# EAGLE design ME433-2021-1 (EAGLE 9.6.2)
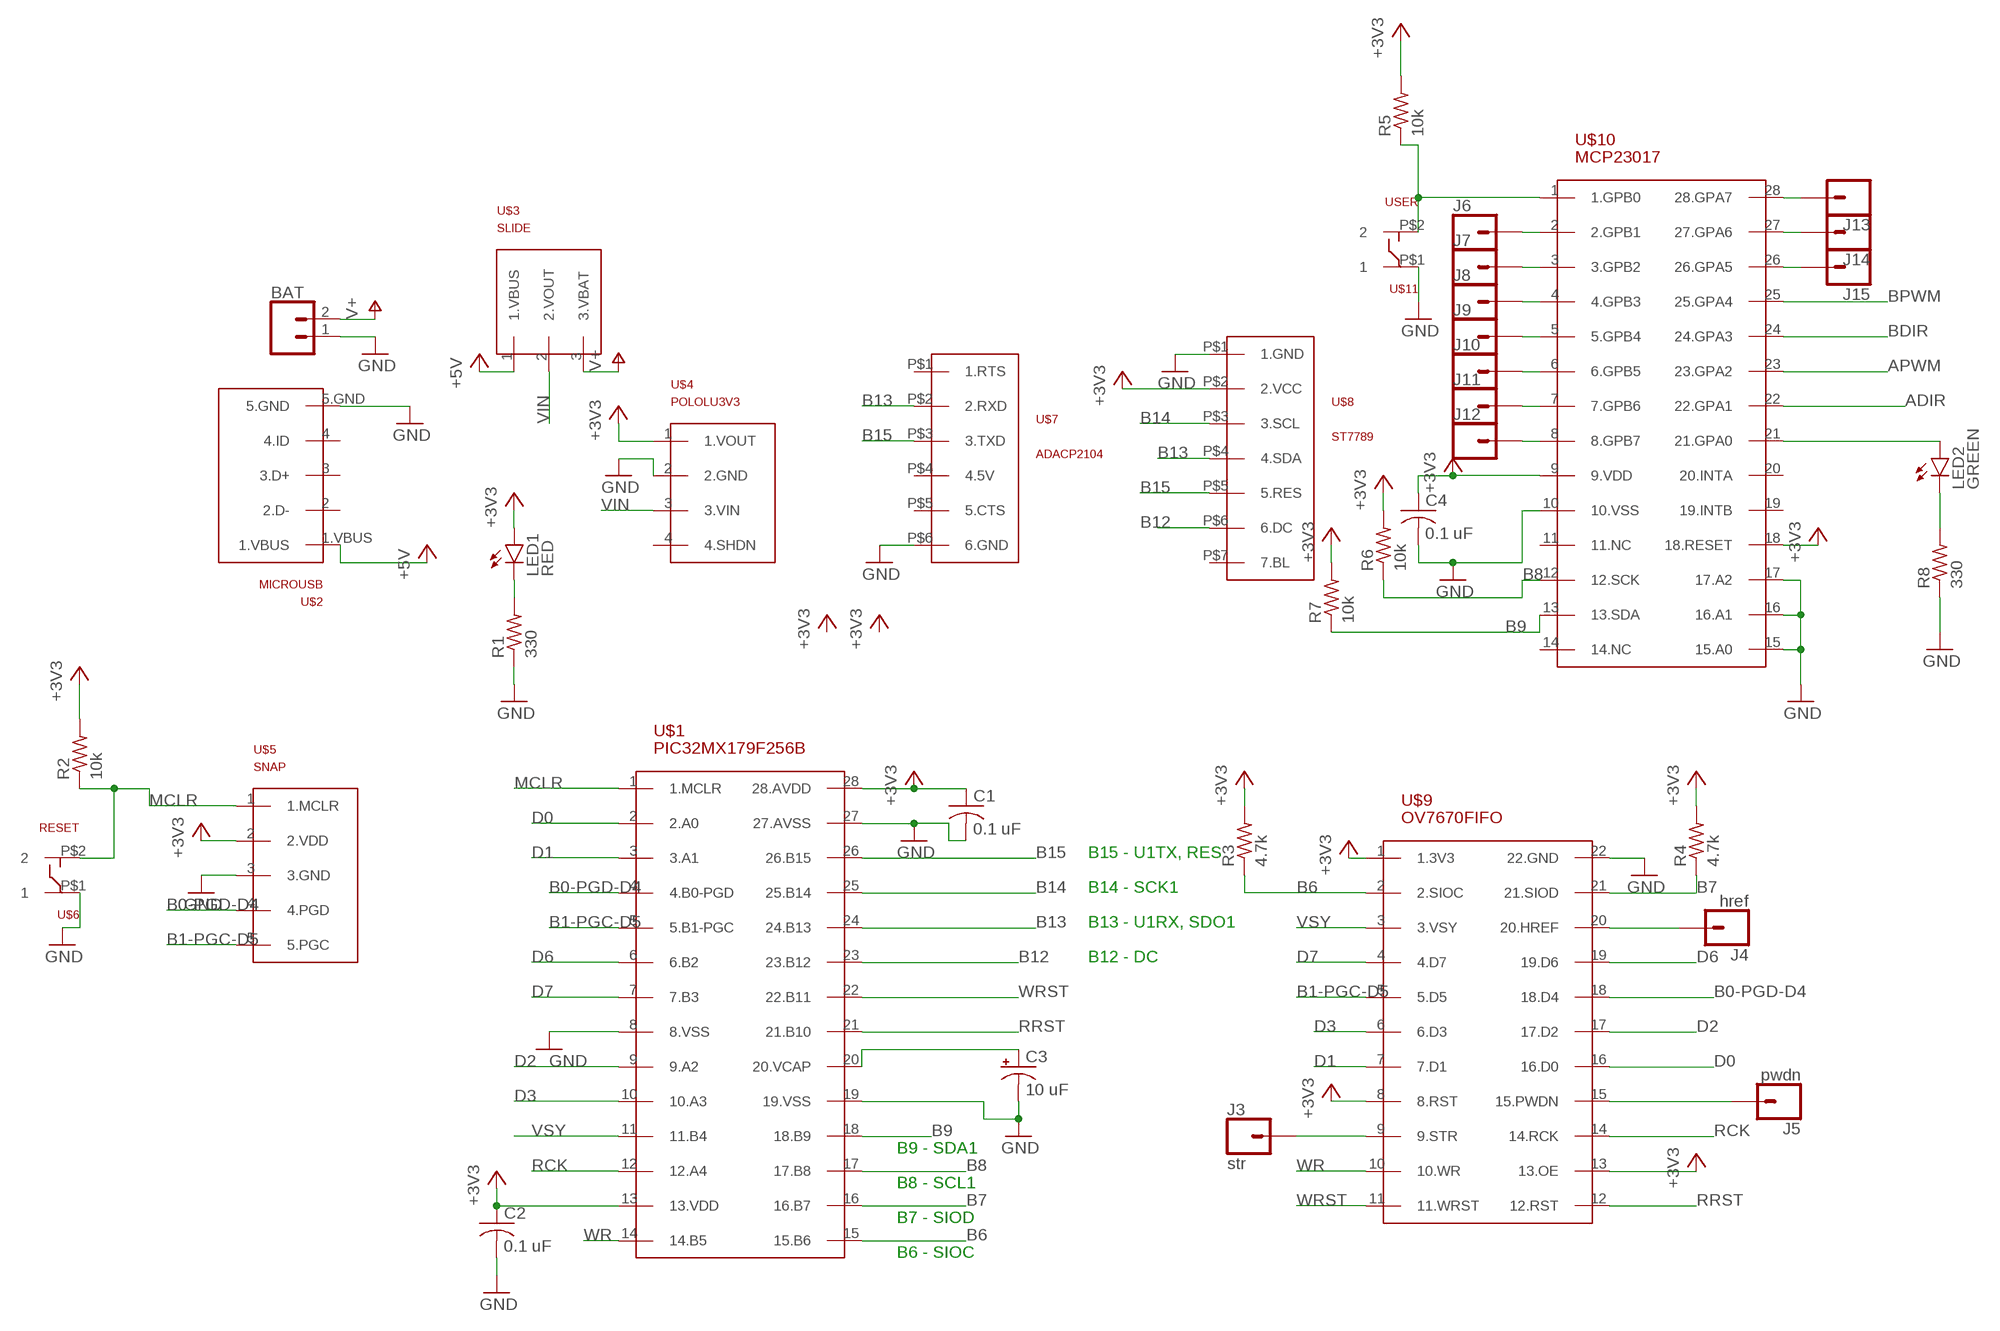
[diagram p0: schematic, sheet 1, part 1 of 2]
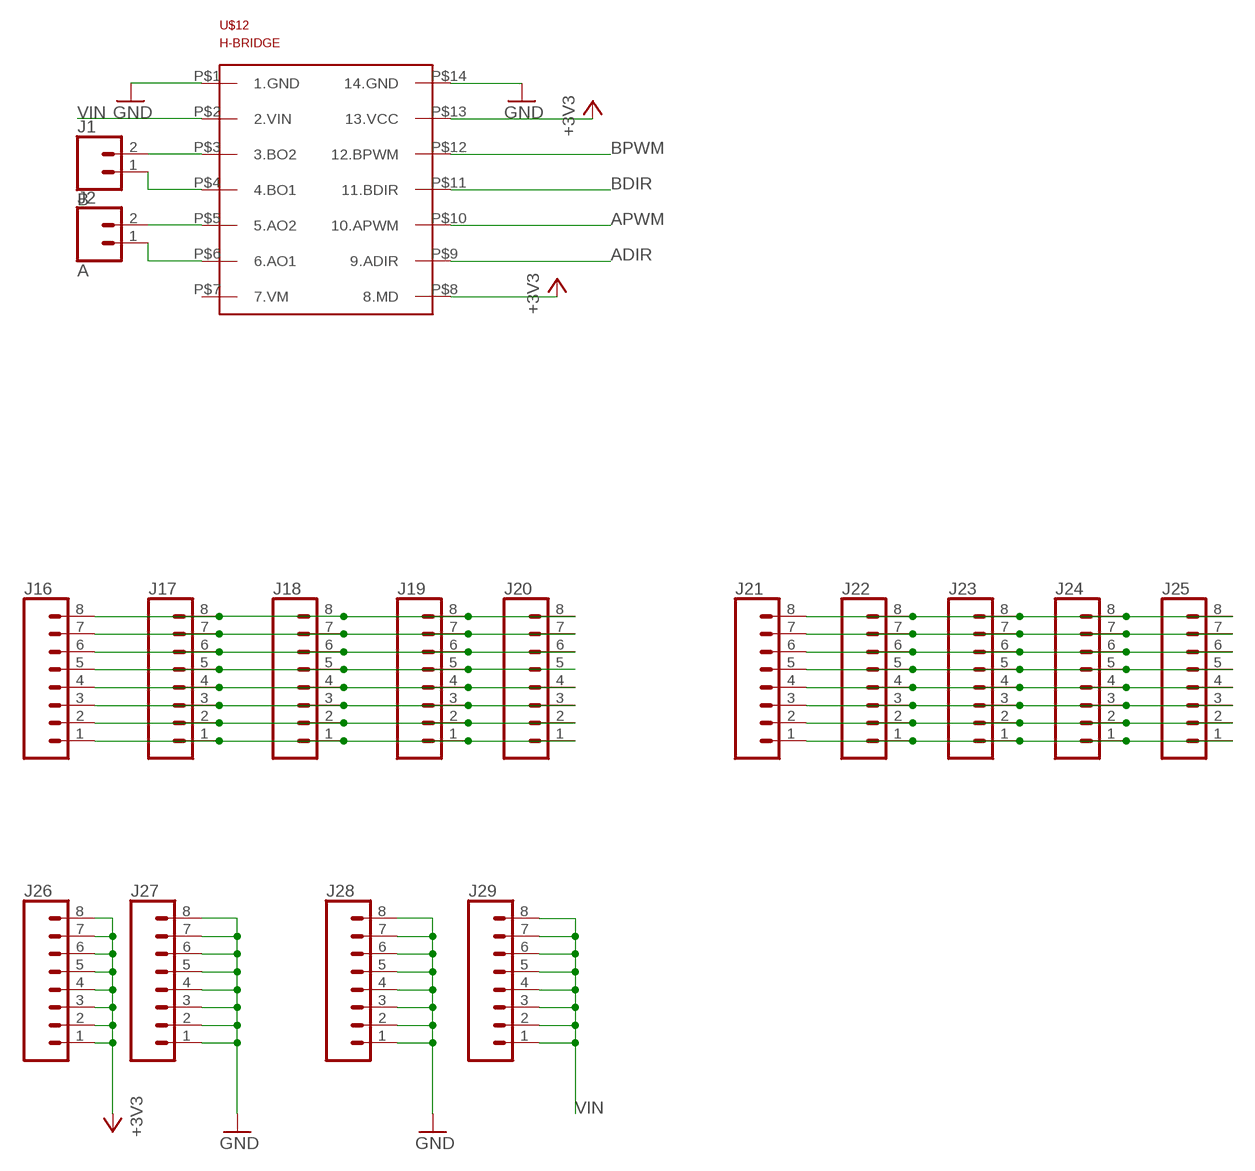
[diagram p1: schematic, sheet 1, part 2 of 2]

## Parts
BAT  CONN_02  [1X02]
C1  0.1 uF  C-US025-030X050  [C025-030X050]
C2  0.1 uF  C-US025-030X050  [C025-030X050]
C3  10 uF  CPOL-USB45181B  [B45181B]
C4  0.1 uF  C-US025-030X050  [C025-030X050]
J1  B  CONN_02  [1X02]
J2  A  CONN_02  [1X02]
J3  str  CONN_01  [1X01]
J4  href  CONN_01  [1X01]
J5  pwdn  CONN_01  [1X01]
J6  CONN_01  [1X01]
J7  CONN_01  [1X01]
J8  CONN_01  [1X01]
J9  CONN_01  [1X01]
J10  CONN_01  [1X01]
J11  CONN_01  [1X01]
J12  CONN_01  [1X01]
J13  CONN_01  [1X01]
J14  CONN_01  [1X01]
J15  CONN_01  [1X01]
J16  CONN_08"  [1X08]
J17  CONN_08"  [1X08]
J18  CONN_08"  [1X08]
J19  CONN_08"  [1X08]
J20  CONN_08"  [1X08]
J21  CONN_08"  [1X08]
J22  CONN_08"  [1X08]
J23  CONN_08"  [1X08]
J24  CONN_08"  [1X08]
J25  CONN_08"  [1X08]
J26  CONN_08"  [1X08]
J27  CONN_08"  [1X08]
J28  CONN_08"  [1X08]
J29  CONN_08"  [1X08]
LED1  RED  LED3MM  [LED3MM]
LED2  GREEN  LED3MM  [LED3MM]
R1  330  R-US_0207/10  [0207/10]
R2  10k  R-US_0207/10  [0207/10]
R3  4.7k  R-US_0207/10  [0207/10]
R4  4.7k  R-US_0207/10  [0207/10]
R5  10k  R-US_0207/10  [0207/10]
R6  10k  R-US_0207/10  [0207/10]
R7  10k  R-US_0207/10  [0207/10]
R8  330  R-US_0207/10  [0207/10]
U$1  PIC32MX179F256B  [DIL28-3]
U$2  MICROUSB  [MICROUSB]
U$3  SLIDE  [SLIDE]
U$4  POLOLU3V3  [POLOLU3V3]
U$5  SNAP  [SNAP]
U$6  RESET  PUSH  [PUSH]
U$7  ADACP2104  [ADACP2104]
U$8  ST7789  [ST7789]
U$9  OV7670FIFO  [OV7670FIFO]
U$10  MCP23017  [DIL28-3]
U$11  USER  PUSH  [PUSH]
U$12  H-BRIDGE  [H-BRIDGE]

## Nets
+3V3: C1.1 C2.1 C4.1 J26.1 J26.2 J26.3 J26.4 J26.5 J26.6 J26.7 J26.8 LED1.A R2.2 R3.2 R4.2 R5.2 R6.2 R7.2 U$1.13(13.VDD) U$1.28(28.AVDD) U$4.1(1.VOUT) U$5.2(2.VDD) U$8.P$2(2.VCC) U$9.1(1.3V3) U$9.8(8.RST) U$9.13(13.OE) U$10.9(9.VDD) U$10.18(18.RESET) U$12.P$8(8.MD) U$12.P$13(13.VCC)
+5V: U$2.1.VBUS U$3.1(1.VBUS)
ADIR: U$10.22(22.GPA1) U$12.P$9(9.ADIR)
APWM: U$10.23(23.GPA2) U$12.P$10(10.APWM)
B0-PGD-D4: U$1.4(4.B0-PGD) U$5.4(4.PGD) U$9.18(18.D4)
B1-PGC-D5: U$1.5(5.B1-PGC) U$5.5(5.PGC) U$9.5(5.D5)
B6: R3.1 U$1.15(15.B6) U$9.2(2.SIOC)
B7: R4.1 U$1.16(16.B7) U$9.21(21.SIOD)
B8: R6.1 U$1.17(17.B8) U$10.12(12.SCK)
B9: R7.1 U$1.18(18.B9) U$10.13(13.SDA)
B12: U$1.23(23.B12) U$8.P$6(6.DC)
B13: U$1.24(24.B13) U$7.P$2(2.RXD) U$8.P$4(4.SDA)
B14: U$1.25(25.B14) U$8.P$3(3.SCL)
B15: U$1.26(26.B15) U$7.P$3(3.TXD) U$8.P$5(5.RES)
BDIR: U$10.24(24.GPA3) U$12.P$11(11.BDIR)
BPWM: U$10.25(25.GPA4) U$12.P$12(12.BPWM)
D0: U$1.2(2.A0) U$9.16(16.D0)
D1: U$1.3(3.A1) U$9.7(7.D1)
D2: U$1.9(9.A2) U$9.17(17.D2)
D3: U$1.10(10.A3) U$9.6(6.D3)
D6: U$1.6(6.B2) U$9.19(19.D6)
D7: U$1.7(7.B3) U$9.4(4.D7)
GND: BAT.1 C1.2 C2.2 C3.- C4.2 J27.1 J27.2 J27.3 J27.4 J27.5 J27.6 J27.7 J27.8 J28.1 J28.2 J28.3 J28.4 J28.5 J28.6 J28.7 J28.8 R1.1 R8.1 U$1.8(8.VSS) U$1.19(19.VSS) U$1.27(27.AVSS) U$2.5.GND U$4.2(2.GND) U$5.3(3.GND) U$6.P$1 U$7.P$6(6.GND) U$8.P$1(1.GND) U$9.22(22.GND) U$10.10(10.VSS) U$10.15(15.A0) U$10.16(16.A1) U$10.17(17.A2) U$11.P$1 U$12.P$1(1.GND) U$12.P$14(14.GND)
MCLR: R2.1 U$1.1(1.MCLR) U$5.1(1.MCLR) U$6.P$2
N$1: LED1.K(C) R1.2
N$2: C3.+ U$1.20(20.VCAP)
N$3: J3.1 U$9.9(9.STR)
N$4: R5.1 U$10.1(1.GPB0) U$11.P$2
N$7: LED2.A U$10.21(21.GPA0)
N$9: LED2.K(C) R8.2
N$10: J6.1 U$10.2(2.GPB1)
N$11: J7.1 U$10.3(3.GPB2)
N$12: J1.2 U$12.P$3(3.BO2)
N$13: J4.1 U$9.20(20.HREF)
N$14: J1.1 U$12.P$4(4.BO1)
N$15: J2.2 U$12.P$5(5.AO2)
N$16: J2.1 U$12.P$6(6.AO1)
N$18: J8.1 U$10.4(4.GPB3)
N$19: J5.1 U$9.15(15.PWDN)
N$20: J9.1 U$10.5(5.GPB4)
N$25: J10.1 U$10.6(6.GPB5)
N$26: J11.1 U$10.7(7.GPB6)
N$27: J12.1 U$10.8(8.GPB7)
N$28: J13.1 U$10.28(28.GPA7)
N$29: J14.1 U$10.27(27.GPA6)
N$30: J15.1 U$10.26(26.GPA5)
N$31: J16.8 J17.8 J18.8 J19.8 J20.8
N$32: J16.7 J17.7 J18.7 J19.7 J20.7
N$33: J16.6 J17.6 J18.6 J19.6 J20.6
N$34: J16.5 J17.5 J18.5 J19.5 J20.5
N$35: J16.4 J17.4 J18.4 J19.4 J20.4
N$36: J16.3 J17.3 J18.3 J19.3 J20.3
N$37: J16.2 J17.2 J18.2 J19.2 J20.2
N$38: J16.1 J17.1 J18.1 J19.1 J20.1
N$39: J21.8 J22.8 J23.8 J24.8 J25.8
N$40: J21.7 J22.7 J23.7 J24.7 J25.7
N$41: J21.5 J22.5 J23.5 J24.5 J25.5
N$42: J21.6 J22.6 J23.6 J24.6 J25.6
N$43: J21.4 J22.4 J23.4 J24.4 J25.4
N$44: J21.3 J22.3 J23.3 J24.3 J25.3
N$45: J21.2 J22.2 J23.2 J24.2 J25.2
N$46: J21.1 J22.1 J23.1 J24.1 J25.1
RCK: U$1.12(12.A4) U$9.14(14.RCK)
RRST: U$1.21(21.B10) U$9.12(12.RST)
V+: BAT.2 U$3.3(3.VBAT)
VIN: J29.1 J29.2 J29.3 J29.4 J29.5 J29.6 J29.7 J29.8 U$3.2(2.VOUT) U$4.3(3.VIN) U$12.P$2(2.VIN)
VSY: U$1.11(11.B4) U$9.3(3.VSY)
WR: U$1.14(14.B5) U$9.10(10.WR)
WRST: U$1.22(22.B11) U$9.11(11.WRST)
Unconnected: U$2.2(2.D-) U$2.3(3.D+) U$2.4(4.ID) U$4.4(4.SHDN) U$7.P$1(1.RTS) U$7.P$4(4.5V) U$7.P$5(5.CTS) U$8.P$7(7.BL) U$10.11(11.NC) U$10.14(14.NC) U$10.19(19.INTB) U$10.20(20.INTA) U$12.P$7(7.VM)

## Notes on the sheet
- B15 - U1TX, RES
- B14 - SCK1
- B13 - U1RX, SDO1
- B12 - DC
- B9 - SDA1
- B8 - SCL1
- B7 - SIOD
- B6 - SIOC

## Library data of the parts
BAT = SparkFun-Connectors:CONN_02: Multi connection point. Often used as Generic Header-pin footprint for 0.1 inch spaced/style header connections On any of the 0.1 inch spaced packages, you can populate with these: Break Away Headers - Straight <https://www.sparkfun.com/products/116> (PRT-00116) Break Away Male Headers - Right Angle <https://www.sparkfun.com/products/553> (PRT-00553) Female Headers <https://www.sparkfun.com/products/115> (PRT-00115) Break Away Headers - Machine Pin <https://www.sparkfun.com/products/117> (PRT-00117) Break Away Female Headers - Swiss Machine Pin <https://www.sparkfun.com/products/743> (PRT-00743) For SCREWTERMINALS and SPRING TERMINALS visit here: Screw Terimnals on SparkFun.com <https://www.sparkfun.com/search/results?term=Screw+Terminals> (5mm/3.5mm/2.54mm spacing) This device is also useful as a general connection point to wire up your design to another part of your project. Our various solder wires solder well into these plated through hole pads. Hook-Up Wire - Assortment (Stranded, 22 AWG) <https://www.sparkfun.com/products/11375> (PRT-11375) Hook-Up Wire - Assortment (Solid Core, 22 AWG) <https://www.sparkfun.com/products/11367> (PRT-11367) View the entire wire category on our website here <https://www.sparkfun.com/categories/141> Special notes: Molex polarized connector foot print use with: PRT-08233 with associated crimp pins and housings. 2.54_SCREWTERM for use with PRT-10571. 3.5mm Screw Terminal footprints for PRT-08084 5mm Screw Terminal footprints for use with PRT-08432
C1 C2 C4 = ME433-2021:C-US: CAPACITOR, American symbol; SPICEPREFIX: C
C3 = ME433-2021:CPOL-US: POLARIZED CAPACITOR, American symbol; SPICEPREFIX: C
J1 J2 = ME433-2021:CONN_02: Multi connection point. Often used as Generic Header-pin footprint for 0.1 inch spaced/style header connections On any of the 0.1 inch spaced packages, you can populate with these: Break Away Headers - Straight <https://www.sparkfun.com/products/116> (PRT-00116) Break Away Male Headers - Right Angle <https://www.sparkfun.com/products/553> (PRT-00553) Female Headers <https://www.sparkfun.com/products/115> (PRT-00115) Break Away Headers - Machine Pin <https://www.sparkfun.com/products/117> (PRT-00117) Break Away Female Headers - Swiss Machine Pin <https://www.sparkfun.com/products/743> (PRT-00743) For SCREWTERMINALS and SPRING TERMINALS visit here: Screw Terimnals on SparkFun.com <https://www.sparkfun.com/search/results?term=Screw+Terminals> (5mm/3.5mm/2.54mm spacing) This device is also useful as a general connection point to wire up your design to another part of your project. Our various solder wires solder well into these plated through hole pads. Hook-Up Wire - Assortment (Stranded, 22 AWG) <https://www.sparkfun.com/products/11375> (PRT-11375) Hook-Up Wire - Assortment (Solid Core, 22 AWG) <https://www.sparkfun.com/products/11367> (PRT-11367) View the entire wire category on our website here <https://www.sparkfun.com/categories/141> Special notes: Molex polarized connector foot print use with: PRT-08233 with associated crimp pins and housings. 2.54_SCREWTERM for use with PRT-10571. 3.5mm Screw Terminal footprints for PRT-08084 5mm Screw Terminal footprints for use with PRT-08432
J3-J15 = ME433-2021:CONN_01: Single connection point. Often used as Generic Header-pin footprint for 0.1 inch spaced/style header connections On any of the 0.1 inch spaced packages, you can populate with these: Break Away Headers - Straight <https://www.sparkfun.com/products/116> (PRT-00116) Break Away Male Headers - Right Angle <https://www.sparkfun.com/products/553> (PRT-00553) Female Headers <https://www.sparkfun.com/products/115> (PRT-00115) Break Away Headers - Machine Pin <https://www.sparkfun.com/products/117> (PRT-00117) Break Away Female Headers - Swiss Machine Pin <https://www.sparkfun.com/products/743> (PRT-00743) This device is also useful as a general connection point to wire up your design to another part of your project. Our various solder wires solder well into these plated through hole pads. Hook-Up Wire - Assortment (Stranded, 22 AWG) <https://www.sparkfun.com/products/11375> (PRT-11375) Hook-Up Wire - Assortment (Solid Core, 22 AWG) <https://www.sparkfun.com/products/11367> (PRT-11367) View the entire wire category on our website here <https://www.sparkfun.com/categories/141> Special notes: SMTSO-256-ET is a "flush mount" nut for a 4-40 screw. We mostly use this on specialty testbeds; it is a nice way to connect hardware to your PCB at an adjustable hieght. Also note, the SNAP packages are for using a snappable style connector. We sell a baggie of snaps and they are also used on two LilyPad designs: Snap Assortment - 30 pack (male and female) <https://www.sparkfun.com/products/11347> (DEV-11347) LilyPad Arduino SimpleSnap <https://www.sparkfun.com/products/10941> (DEV-10941) LilyPad SimpleSnap Protoboard <https://www.sparkfun.com/products/10940> (DEV-10940)
J16-J29 = ME433-2021:CONN_08: Multi connection point. Often used as Generic Header-pin footprint for 0.1 inch spaced/style header connections On any of the 0.1 inch spaced packages, you can populate with these: Break Away Headers - Straight <https://www.sparkfun.com/products/116> (PRT-00116) Break Away Male Headers - Right Angle <https://www.sparkfun.com/products/553> (PRT-00553) Female Headers <https://www.sparkfun.com/products/115> (PRT-00115) Break Away Headers - Machine Pin <https://www.sparkfun.com/products/117> (PRT-00117) Break Away Female Headers - Swiss Machine Pin <https://www.sparkfun.com/products/743> (PRT-00743) Arduino Stackable Header - 8 Pin <https://www.sparkfun.com/products/9279> (PRT-09279) For SCREWTERMINALS and SPRING TERMINALS visit here: Screw Terimnals on SparkFun.com <https://www.sparkfun.com/search/results?term=Screw+Terminals> (5mm/3.5mm/2.54mm spacing) This device is also useful as a general connection point to wire up your design to another part of your project. Our various solder wires solder well into these plated through hole pads. Hook-Up Wire - Assortment (Stranded, 22 AWG) <https://www.sparkfun.com/products/11375> (PRT-11375) Hook-Up Wire - Assortment (Solid Core, 22 AWG) <https://www.sparkfun.com/products/11367> (PRT-11367) View the entire wire category on our website here <https://www.sparkfun.com/categories/141> Special notes: Molex polarized connector foot print use with SKU : PRT-08231 with associated crimp pins and housings. 1MM SMD Version SKU: PRT-10208 NOTES ON THE VARIANTS LOCK and LOCK_LONGPADS... This footprint was designed to help hold the alignment of a through-hole component (i.e. 6-pin header) while soldering it into place. You may notice that each hole has been shifted either up or down by 0.005 of an inch from it's more standard position (which is a perfectly straight line). This slight alteration caused the pins (the squares in the middle) to touch the edges of the holes. Because they are alternating, it causes a "brace" to hold the component in place. 0.005 has proven to be the perfect amount of "off-center" position when using our standard breakaway headers. Although looks a little odd when you look at the bare footprint, once you have a header in there, the alteration is very hard to notice. Also,if you push a header all the way into place, it is covered up entirely on the bottom side.; PROD_ID: CONN-08438
LED1 LED2 = ME433-2021:LED: LED OSRAM: - CHIPLED LG R971, LG N971, LY N971, LG Q971, LY Q971, LO R971, LY R971 LH N974, LH R974 LS Q976, LO Q976, LY Q976 LO Q996 - Hyper CHIPLED LW Q18S LB Q993, LB Q99A, LB R99A - SideLED LS A670, LO A670, LY A670, LG A670, LP A670 LB A673, LV A673, LT A673, LW A673 LH A674 LY A675 LS A676, LA A676, LO A676, LY A676, LW A676 LS A679, LY A679, LG A679 - Hyper Micro SIDELED® LS Y876, LA Y876, LO Y876, LY Y876 LT Y87S - SmartLED LW L88C, LW L88S LB L89C, LB L89S, LG L890 LS L89K, LO L89K, LY L89K LS L896, LA L896, LO L896, LY L896 - TOPLED LS T670, LO T670, LY T670, LG T670, LP T670 LSG T670, LSP T670, LSY T670, LOP T670, LYG T670 LG T671, LOG T671, LSG T671 LB T673, LV T673, LT T673, LW T673 LH T674 LS T676, LA T676, LO T676, LY T676, LB T676, LH T676, LSB T676, LW T676 LB T67C, LV T67C, LT T67C, LS T67K, LO T67K, LY T67K, LW E67C LS E67B, LA E67B, LO E67B, LY E67B, LB E67C, LV E67C, LT E67C LW T67C LS T679, LY T679, LG T679 LS T770, LO T770, LY T770, LG T770, LP T770 LB T773, LV T773, LT T773, LW T773 LH T774 LS E675, LA E675, LY E675, LS T675 LS T776, LA T776, LO T776, LY T776, LB T776 LHGB T686 LT T68C, LB T68C - Hyper Mini TOPLED® LB M676 - Mini TOPLED Santana® LG M470 LS M47K, LO M47K, LY M47K Source: http://www.osram.convergy.de LUXEON: - LUMILED® LXK2-PW12-R00, LXK2-PW12-S00, LXK2-PW14-U00, LXK2-PW14-V00 LXK2-PM12-R00, LXK2-PM12-S00, LXK2-PM14-U00 LXK2-PE12-Q00, LXK2-PE12-R00, LXK2-PE12-S00, LXK2-PE14-T00, LXK2-PE14-U00 LXK2-PB12-K00, LXK2-PB12-L00, LXK2-PB12-M00, LXK2-PB14-N00, LXK2-PB14-P00, LXK2-PB14-Q00 LXK2-PR12-L00, LXK2-PR12-M00, LXK2-PR14-Q00, LXK2-PR14-R00 LXK2-PD12-Q00, LXK2-PD12-R00, LXK2-PD12-S00 LXK2-PH12-R00, LXK2-PH12-S00 LXK2-PL12-P00, LXK2-PL12-Q00, LXK2-PL12-R00 Source: www.luxeon.com KINGBRIGHT: KA-3528ASYC Source: www.kingbright.com
R1-R8 = ME433-2021:R-US_: RESISTOR, American symbol; SPICEPREFIX: R
U$1 = ME433-2021:PIC32MX179F256B
U$2 = ME433-2021:MICROUSB
U$3 = ME433-2021:SLIDE
U$4 = ME433-2021:POLOLU3V3
U$5 = ME433-2021:SNAP
U$6 U$11 = ME433-2021:PUSH
U$7 = ME433-2021:ADACP2104
U$8 = ME433-2021:ST7789
U$9 = ME433-2021:OV7670FIFO
U$10 = ME433-2021:MCP23017
U$12 = ME433-2021:H-BRIDGE

## Board
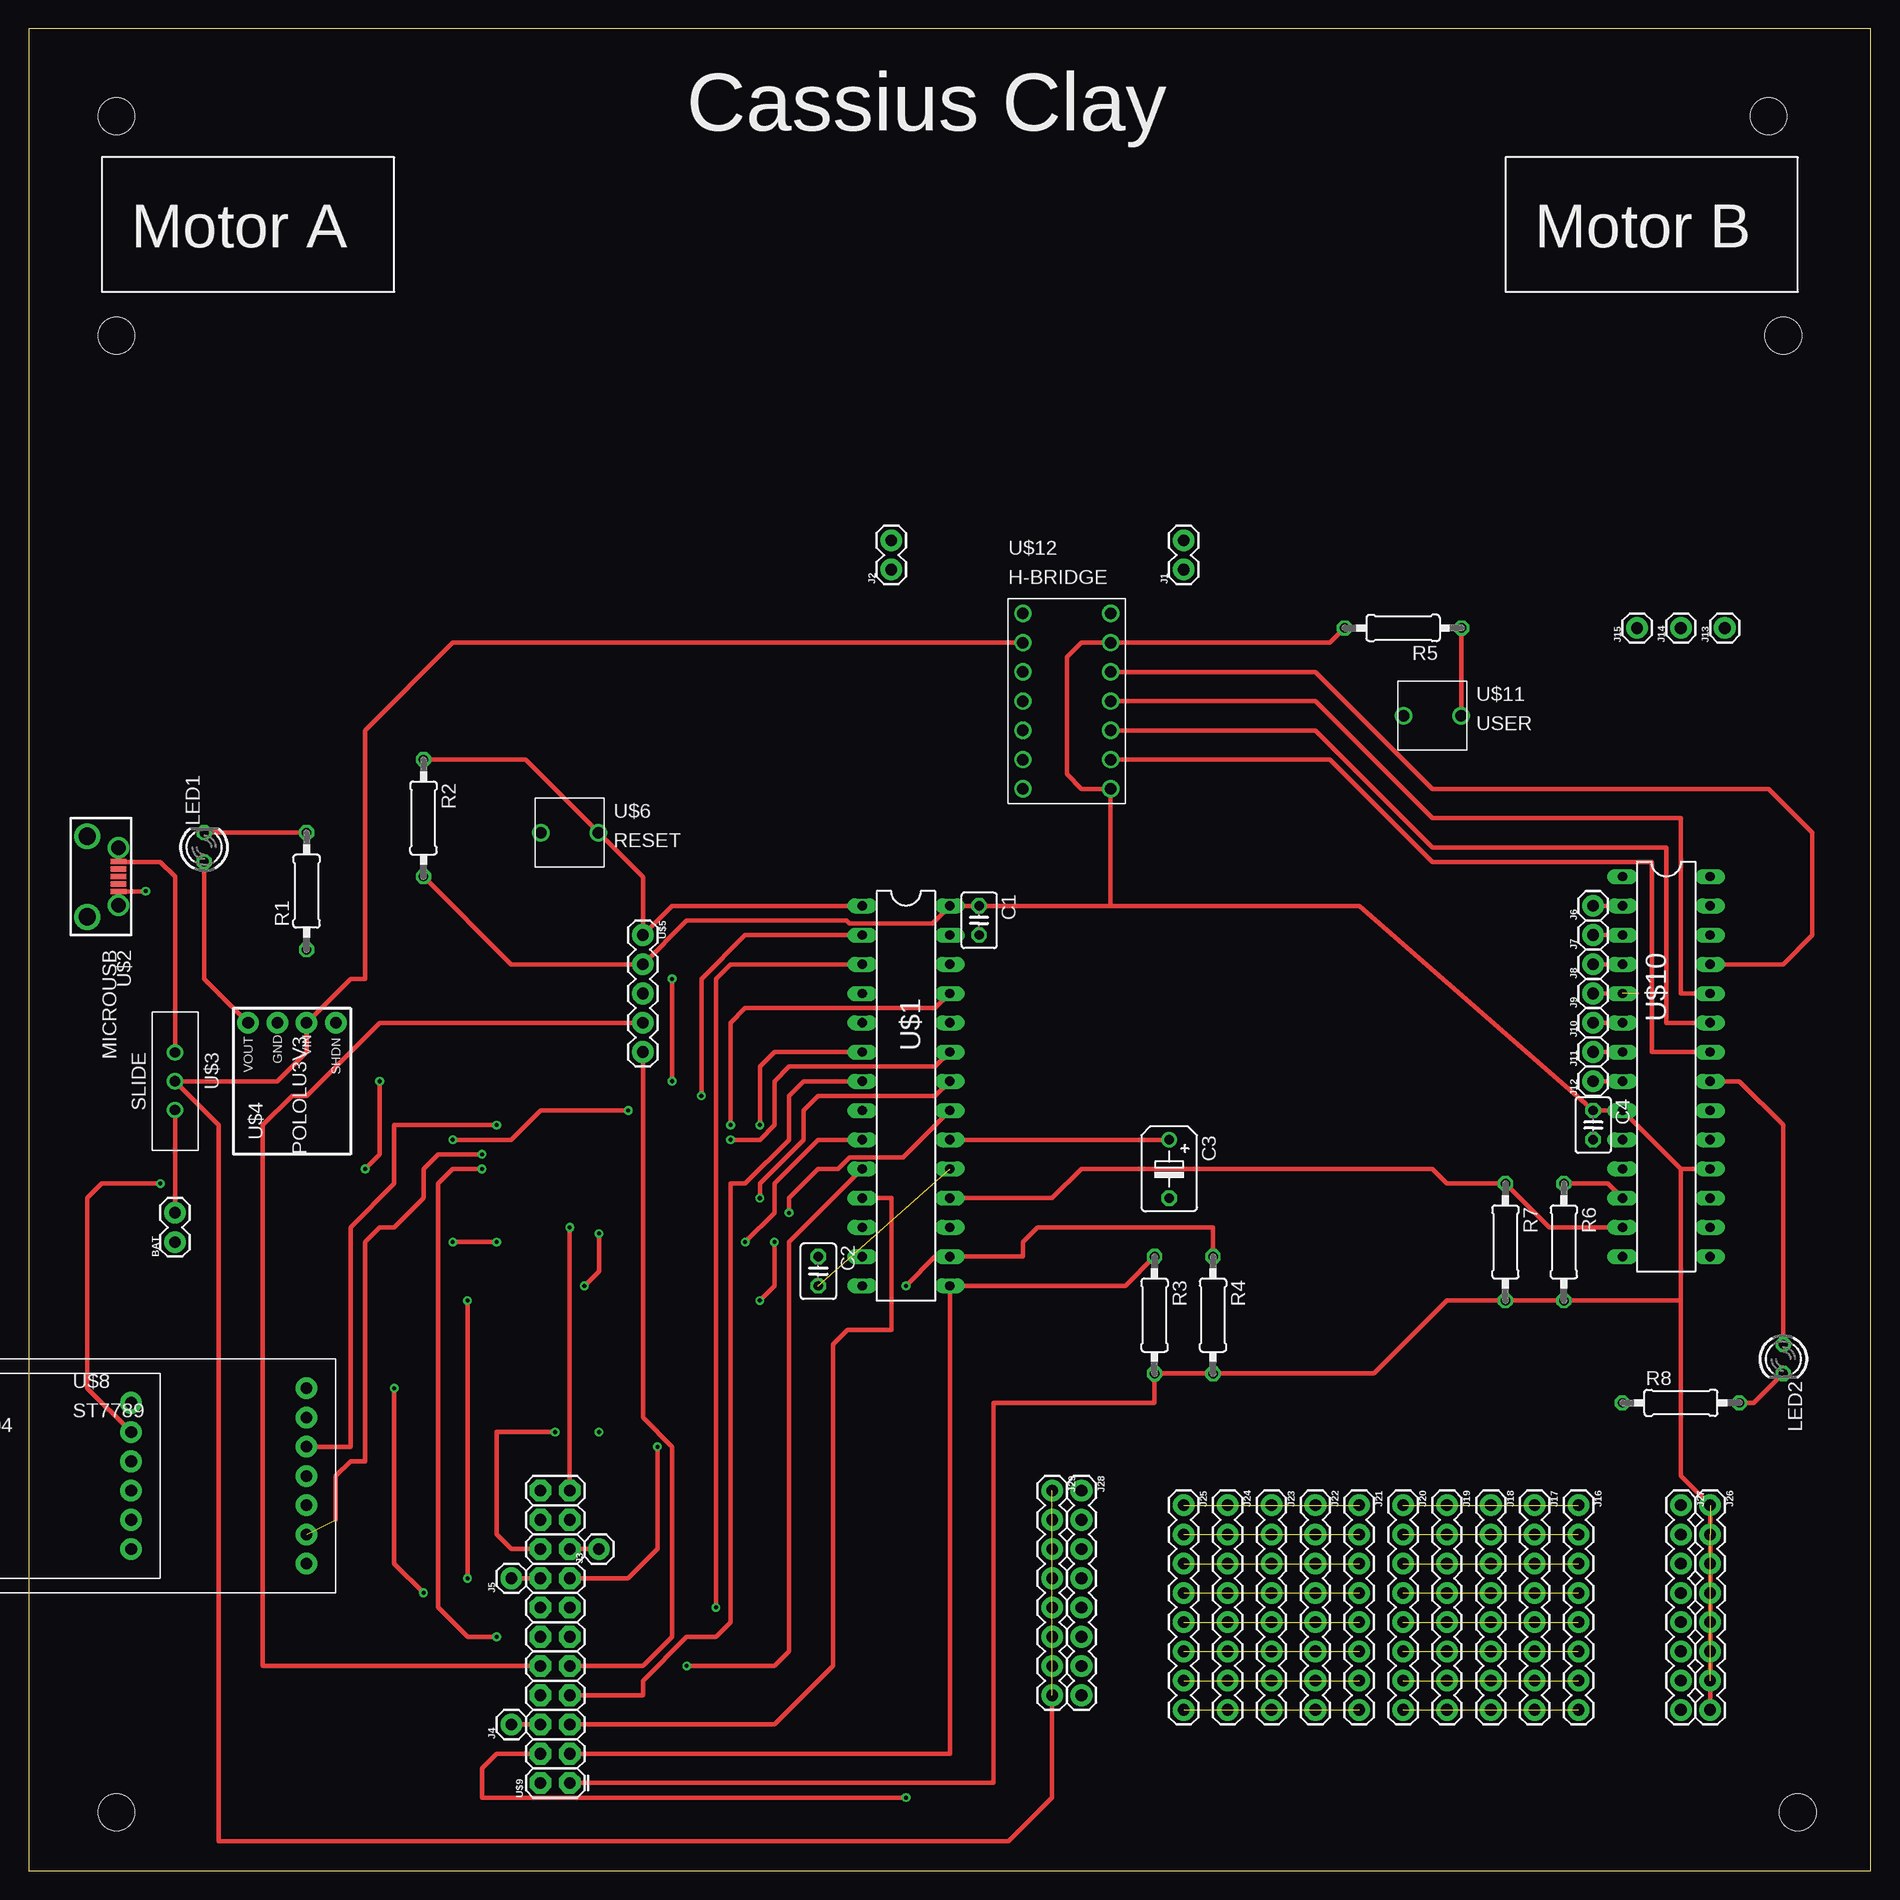
[diagram p2: board, top side]
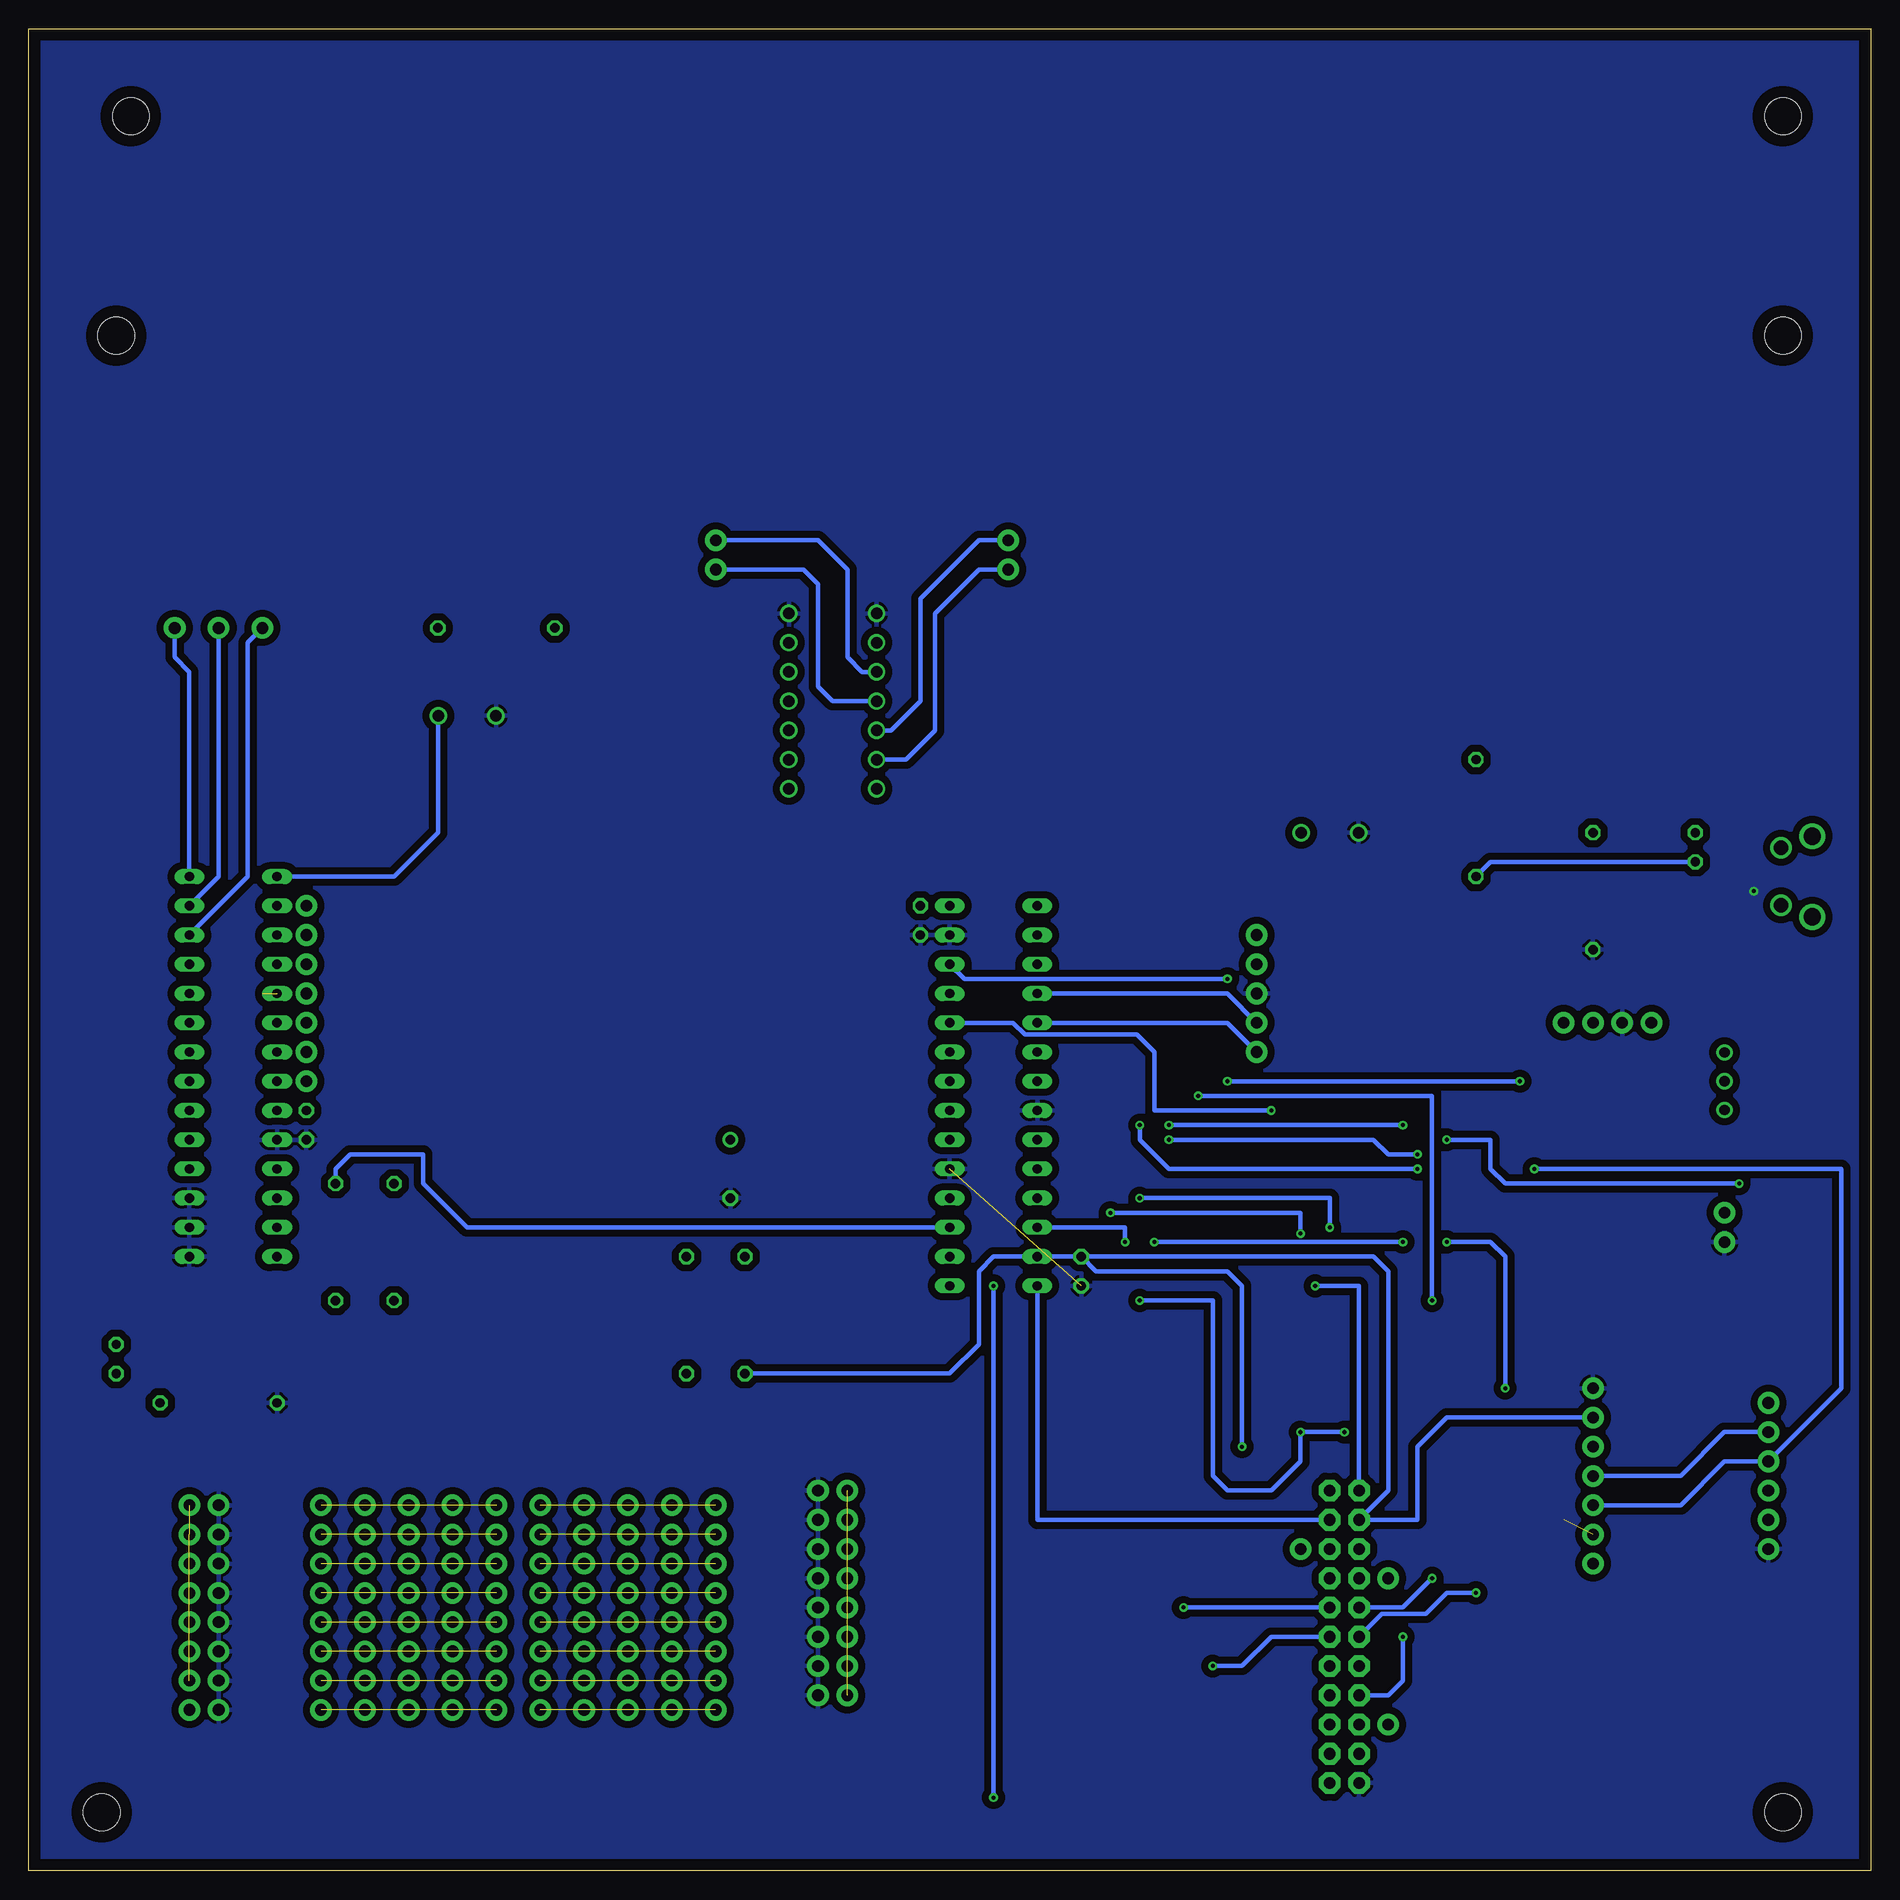
[diagram p3: board, bottom side, seen from below]

Size 160 x 160 mm. Coordinates in mm from the lower left corner, seen from the top.
Outline: 0,0 160,0 160,160 0,160 0,0
Copper layers (1*16): Top 0.035mm / dielectric 1.5mm / Bottom 0.035mm
Design rules "default": minimum track width 6mil, minimum drill 0.35mm, track to track 6mil, track to pad 6mil, pad to pad 6mil, via to via 6mil, smd to smd 6mil, copper to edge 40mil, drill to drill 6mil, minimum pad ring 10mil, minimum via ring 8mil, stop-mask expansion 4mil, vias tented up to drill 0mil, thermal gap 10mil
Holes 3.17 mm at 7.62,152.4 7.62,133.35 151.13,152.4 152.4,133.35 7.62,5.08 153.67,5.08

### Footprints (pad centres in the part's own frame; a part is rotated, then mirrored left to right if it is on the bottom)
1X02 = drill 1.016 pad 1.88: 1 0,0; 2 2.54,0
C025-030X050 = drill 0.813 octagon: 1 -1.27,0; 2 1.27,0
B45181B = drill 0.813: + -2.54,0 | drill 0.813 octagon: - 2.54,0
1X01 = drill 1.016 pad 1.88: 1 0,0
1X08 = drill 1.016 pad 1.88: 1 0,0; 2 2.54,0; 3 5.08,0; 4 7.62,0; 5 10.16,0; 6 12.7,0; 7 15.24,0; 8 17.78,0
LED3MM = drill 0.813 octagon: A -1.27,0; K 1.27,0
0207/10 = drill 0.813 octagon: 1 -5.08,0; 2 5.08,0
DIL28-3 = drill 0.813 long: 1 -16.51,-3.81; 2 -13.97,-3.81; 3 -11.43,-3.81; 4 -8.89,-3.81; 5 -6.35,-3.81; 6 -3.81,-3.81; 7 -1.27,-3.81; 8 1.27,-3.81; 9 3.81,-3.81; 10 6.35,-3.81; 11 8.89,-3.81; 12 11.43,-3.81; 13 13.97,-3.81; 14 16.51,-3.81; 15 16.51,3.81; 16 13.97,3.81; 17 11.43,3.81; 18 8.89,3.81; 19 6.35,3.81; 20 3.81,3.81; 21 1.27,3.81; 22 -1.27,3.81; 23 -3.81,3.81; 24 -6.35,3.81; 25 -8.89,3.81; 26 -11.43,3.81; 27 -13.97,3.81; 28 -16.51,3.81
MICROUSB = smd 0.4 x 1.35: 1.VBUS -1.3,2.7; 2 -0.65,2.7; 3 0,2.7; 4 0.65,2.7; 5.GND 1.3,2.7 | drill 1.25 pad 1.676: P$6 -2.5,2.7; P$7 2.5,2.7 | drill 1.5: P$8 -3.5,0; P$9 3.5,0
SLIDE = drill 0.9: 1 -2.5,0; 2 0,0; 3 2.5,0
POLOLU3V3 = drill 1.016 pad 1.88: 1 0,3.81; 2 0,1.27; 3 0,-1.27; 4 0,-3.81
SNAP = drill 1.016 pad 1.88: 1 0,5.08; 2 0,2.54; 3 0,0; 4 0,-2.54; 5 0,-5.08
PUSH = drill 1: P$1 -2.5,0; P$2 2.5,0
ADACP2104 = drill 1.016 pad 1.88: P$1 0,6.35; P$2 0,3.81; P$3 0,1.27; P$4 0,-1.27; P$5 0,-3.81; P$6 0,-6.35
ST7789 = drill 1.016 pad 1.88: P$1 0,7.62; P$2 0,5.08; P$3 0,2.54; P$4 0,0; P$5 0,-2.54; P$6 0,-5.08; P$7 0,-7.62
OV7670FIFO = drill 1.016 pad 1.88 octagon: 1 1.27,-12.7; 2 1.27,-10.16; 3 1.27,-7.62; 4 1.27,-5.08; 5 1.27,-2.54; 6 1.27,0; 7 1.27,2.54; 8 1.27,5.08; 9 1.27,7.62; 10 1.27,10.16; 11 1.27,12.7; 12 -1.27,12.7; 13 -1.27,10.16; 14 -1.27,7.62; 15 -1.27,5.08; 16 -1.27,2.54; 17 -1.27,0; 18 -1.27,-2.54; 19 -1.27,-5.08; 20 -1.27,-7.62; 21 -1.27,-10.16; 22 -1.27,-12.7
H-BRIDGE = drill 1 pad 1.02: P$1 -3.81,7.62; P$2 -3.81,5.08; P$3 -3.81,2.54; P$4 -3.81,0; P$5 -3.81,-2.54; P$6 -3.81,-5.08; P$7 -3.81,-7.62; P$8 3.81,-7.62; P$9 3.81,-5.08; P$10 3.81,-2.54; P$11 3.81,0; P$12 3.81,2.54; P$13 3.81,5.08; P$14 3.81,7.62

### Placement (x,y rotation side)
BAT  12.7,54.61 90 top
C1  82.55,82.55 270 top
C2  68.58,52.07 270 top
C3  99.06,60.96 270 top
C4  135.89,64.77 270 top
J1  100.33,113.03 90 top
J2  74.93,113.03 90 top
J3  49.53,27.94 90 top
J4  41.91,12.7 90 top
J5  41.91,25.4 90 top
J6  135.89,83.82 90 top
J7  135.89,81.28 90 top
J8  135.89,78.74 90 top
J9  135.89,76.2 90 top
J10  135.89,73.66 90 top
J11  135.89,71.12 90 top
J12  135.89,68.58 90 top
J13  147.32,107.95 90 top
J14  143.51,107.95 90 top
J15  139.7,107.95 90 top
J16  134.62,31.75 270 top
J17  130.81,31.75 270 top
J18  127,31.75 270 top
J19  123.19,31.75 270 top
J20  119.38,31.75 270 top
J21  115.57,31.75 270 top
J22  111.76,31.75 270 top
J23  107.95,31.75 270 top
J24  104.14,31.75 270 top
J25  100.33,31.75 270 top
J26  146.05,31.75 270 top
J27  143.51,31.75 270 top
J28  91.44,33.02 270 top
J29  88.9,33.02 270 top
LED1  15.24,88.9 90 top
LED2  152.4,44.45 270 top
R1  24.13,85.09 90 top
R2  34.29,91.44 270 top
R3  97.79,48.26 270 top
R4  102.87,48.26 270 top
R5  119.38,107.95 180 top
R6  133.35,54.61 270 top
R7  128.27,54.61 270 top
R8  143.51,40.64 0 top
U$1  76.2,67.31 270 top
U$2  5.08,86.36 270 top
U$3  12.7,68.58 270 top
U$4  22.86,73.66 90 top
U$5  53.34,76.2 0 top
U$6  46.99,90.17 0 top
U$7  8.89,34.29 0 top
U$8  24.13,34.29 0 top
U$9  45.72,20.32 0 top
U$10  142.24,69.85 270 top
U$11  121.92,100.33 0 top
U$12  90.17,101.6 0 top

### Tracks (layer width: path | path; a pad name or v marks a point on that pad's centre or on a via)
+3V3  (via drill 0.35)  (6 unrouted)
  Top 0.406: U$4.1 15.24,77.47 LED1.A | R2.2 41.91,78.74 U$5.2 57.15,82.55 71.06,82.55 71.31,82.3 78.49,82.3 U$1.28 C1.1 93.98,83.82 | 93.98,83.82 U$12.P$8 91.44,93.98 90.17,95.25 90.17,105.41 91.44,106.68 U$12.P$13 113.03,106.68 R5.2 | 93.98,83.82 115.57,83.82 C4.1 U$10.9 143.51,60.96 | U$10.18 143.51,60.96 | 143.51,60.96 143.51,49.53 | 143.51,49.53 143.51,34.29 J26.1 J26.8 | 143.51,49.53 R6.2 R7.2 123.19,49.53 116.84,43.18 R3.2 | R3.2 R4.2 | U$9.1 83.82,7.62 83.82,40.64 97.79,40.64 R3.2 | U$9.8 52.07,25.4 54.61,27.94 v54.61,36.83
  Bottom 0.406: LED1.A 33.02,87.63 R2.2 | U$8.P$2 36.83,39.37 39.37,36.83 39.37,30.48 U$9.13 41.91,33.02 41.91,52.07 43.18,53.34 C2.1 | R3.2 80.01,43.18 77.47,45.72 77.47,52.07 76.2,53.34 U$1.13 C2.1 | v54.61,36.83 54.61,50.8 55.88,52.07 67.31,52.07 C2.1
+5V
  Top 0.406: U$2.1.VBUS 7.81,87.63 11.43,87.63 12.7,86.36 U$3.1
ADIR
  Top 0.406: U$12.P$9 113.03,96.52 121.92,87.63 140.97,87.63 140.97,71.12 U$10.22
APWM
  Top 0.406: U$12.P$10 111.76,99.06 121.92,88.9 142.24,88.9 142.24,73.66 U$10.23
B0-PGD-D4
  Top 0.406: U$5.4 30.48,73.66 24.13,67.31 22.86,67.31 20.32,64.77 20.32,17.78 U$9.18
  Bottom 0.406: U$5.4 55.88,76.2 U$1.4
B1-PGC-D5
  Top 0.406: U$9.5 53.34,17.78 55.88,20.32 55.88,36.83 53.34,39.37 U$5.5
  Bottom 0.406: U$5.5 55.88,73.66 U$1.5
B6
  Top 0.406: R3.1 95.25,50.8 U$1.15 80.01,10.16 U$9.2
B7  (via drill 0.35)
  Top 0.406: R4.1 102.87,55.88 87.63,55.88 86.36,54.61 86.36,53.34 U$1.16 78.74,53.34 v76.2,50.8 | U$9.21 40.64,10.16 39.37,8.89 39.37,6.35 43.89,6.35 43.91,6.33 47.53,6.33 47.55,6.35 v76.2,6.35
  Bottom 0.406: v76.2,6.35 v76.2,50.8
B8
  Top 0.406: R6.1 137.16,59.69 U$10.12
  Bottom 0.406: U$1.17 121.92,55.88 125.73,59.69 125.73,62.23 132.08,62.23 133.35,60.96 R6.1
B9
  Top 0.406: U$10.13 132.08,55.88 R7.1 123.19,59.69 121.92,60.96 91.44,60.96 88.9,58.42 U$1.18
B12  (via drill 0.35)  (1 unrouted)
  Top 0.406: U$1.23 78.74,69.85 66.04,69.85 64.77,68.58 64.77,67.31 64.77,64.77 63.5,63.5 v60.96,63.5 | v39.37,62.23 35.56,62.23 34.29,60.96 34.29,58.42 31.75,55.88 30.48,55.88 29.21,54.61 29.21,35.56 27.94,35.56 26.67,34.29 26.67,30.48
  Bottom 0.406: v60.96,63.5 43.18,63.5 41.91,62.23 v39.37,62.23
B13  (via drill 0.35)
  Top 0.406: U$7.P$2 5.08,41.91 5.08,58.42 6.35,59.69 v11.43,59.69 | v36.83,63.5 41.91,63.5 44.45,66.04 v52.07,66.04
  Bottom 0.406: U$7.P$2 12.7,38.1 16.51,34.29 U$8.P$4 | v11.43,59.69 31.75,59.69 33.02,60.96 33.02,63.5 v36.83,63.5 | v52.07,66.04 62.23,66.04 62.23,71.12 63.75,72.64 73.47,72.64 74.49,73.66 U$1.24
B14  (via drill 0.35)
  Top 0.406: v40.64,64.77 31.75,64.77 31.75,59.69 27.94,55.88 27.94,36.83 U$8.P$3 | U$1.25 78.74,74.93 62.23,74.93 60.96,73.66 v60.96,64.77
  Bottom 0.406: v60.96,64.77 v40.64,64.77
B15  (via drill 0.35)
  Top 0.406: v55.88,77.47 v55.88,68.58 | v30.48,68.58 30.48,62.23 v29.21,60.96
  Bottom 0.406: U$8.P$5 16.51,31.75 12.7,35.56 U$7.P$3 2.54,41.91 2.54,60.96 v29.21,60.96 | U$1.26 78.74,77.47 v55.88,77.47 | v55.88,68.58 v30.48,68.58
BDIR
  Top 0.406: U$12.P$11 111.76,101.6 121.92,91.44 143.51,91.44 143.51,76.2 U$10.24
BPWM
  Top 0.406: U$12.P$12 111.76,104.14 121.92,93.98 151.13,93.98 154.94,90.17 154.94,81.28 152.4,78.74 U$10.25
D0  (via drill 0.35)
  Top 0.406: U$1.2 62.23,81.28 58.42,77.47 v58.42,67.31 | v38.1,49.53 v38.1,25.4
  Bottom 0.406: v58.42,67.31 38.1,67.31 v38.1,49.53 | v38.1,25.4 40.64,22.86 U$9.16
D1  (via drill 0.35)
  Top 0.406: U$1.3 60.96,78.74 59.69,77.47 v59.69,22.86
  Bottom 0.406: v59.69,22.86 U$9.7
D2  (via drill 0.35)
  Top 0.406: U$1.9 68.58,63.5 64.77,59.69 64.77,57.15 v62.23,54.61 | v40.64,54.61 v36.83,54.61 | v31.75,41.91 31.75,26.67 v34.29,24.13
  Bottom 0.406: v62.23,54.61 v40.64,54.61 | v36.83,54.61 33.02,54.61 31.75,53.34 v31.75,41.91 | v34.29,24.13 36.83,24.13 38.66,22.3 42.47,22.3 U$9.17
D3  (via drill 0.35)
  Top 0.406: U$1.10 66.04,54.61 66.04,19.05 64.77,17.78 v57.15,17.78
  Bottom 0.406: v57.15,17.78 54.61,17.78 52.07,20.32 U$9.6
D6  (via drill 0.35)
  Top 0.406: U$1.6 64.77,71.12 63.5,69.85 v63.5,64.77 | v39.37,60.96 36.83,60.96 35.56,59.69 35.56,22.86 38.1,20.32 v40.64,20.32
  Bottom 0.406: v63.5,64.77 63.5,63.5 60.96,60.96 v39.37,60.96 | v40.64,20.32 40.64,16.51 41.91,15.24 U$9.19
D7
  Top 0.406: U$1.7 67.31,68.58 66.04,67.31 66.04,63.5 62.23,59.69 60.96,59.69 60.96,21.59 59.69,20.32 57.15,20.32 53.34,16.51 53.34,15.24 U$9.4
GND  (via drill 0.35)  (1 unrouted)
  Top 0.406: U$2.5.GND 10.13,85.06 v10.16,85.09
  pour Bottom (isolate 0.61): 0,0 160.02,0 160.02,160.02 0,160.02
MCLR
  Top 0.406: R2.1 43.14,96.52 U$6.P$2 53.34,86.32 U$5.1 55.88,83.82 U$1.1
N$1
  Top 0.406: LED1.K R1.2
N$2
  Top 0.406: U$1.20 C3.+
N$3
  Top 0.406: U$9.9 J3.1
N$4
  Top 0.406: R5.1 124.46,100.37 U$11.P$2
  Bottom 0.406: U$11.P$2 124.46,100.29 124.46,90.17 128.27,86.36 U$10.1
N$7
  Top 0.406: U$10.21 148.59,68.58 152.4,64.77 LED2.A
N$9
  Top 0.406: R8.2 149.86,40.64 LED2.K
N$10
  Top 0.406: J6.1 U$10.2
N$11
  Top 0.406: U$10.3 J7.1
N$12
  Bottom 0.406: J1.2 91.44,115.57 88.9,113.03 88.9,105.41 87.63,104.14 U$12.P$3
N$13
  Top 0.406: J4.1 U$9.20
N$14
  Bottom 0.406: U$12.P$4 90.17,101.6 91.44,102.87 91.44,111.76 92.71,113.03 J1.1
N$15
  Bottom 0.406: J2.2 77.47,115.57 82.55,110.49 82.55,101.6 85.09,99.06 U$12.P$5
N$16
  Bottom 0.406: J2.1 77.47,113.03 81.28,109.22 81.28,99.06 83.82,96.52 U$12.P$6
N$18
  Top 0.406: J8.1 U$10.4
N$19
  Top 0.406: J5.1 U$9.15
N$20  (1 unrouted)
  Top 0.406: J9.1 139.7,76.2
N$25
  Top 0.406: J10.1 U$10.6
N$26
  Top 0.406: J11.1 U$10.7
N$27
  Top 0.406: J12.1 U$10.8
N$28
  Bottom 0.406: U$10.28 146.05,104.14 147.32,105.41 J13.1
N$29
  Bottom 0.406: U$10.27 143.51,86.36 J14.1
N$30
  Bottom 0.406: J15.1 140.97,106.68 140.97,86.36 U$10.26
N$31  (4 unrouted)
N$32  (4 unrouted)
N$33  (4 unrouted)
N$34  (4 unrouted)
N$35  (4 unrouted)
N$36  (4 unrouted)
N$37  (4 unrouted)
N$38  (4 unrouted)
N$39  (4 unrouted)
N$40  (4 unrouted)
N$41  (4 unrouted)
N$42  (4 unrouted)
N$43  (4 unrouted)
N$44  (4 unrouted)
N$45  (4 unrouted)
N$46  (4 unrouted)
RCK  (via drill 0.35)
  Top 0.406: v64.77,54.61 64.77,50.8 v63.5,49.53 | v45.72,38.1 40.64,38.1 40.64,29.21 41.91,27.94 U$9.14
  Bottom 0.406: v64.77,54.61 64.77,55.88 U$1.12 | v63.5,49.53 57.15,49.53 57.15,34.29 55.88,33.02 52.07,33.02 49.53,35.56 v49.53,38.1 v45.72,38.1
RRST  (via drill 0.35)
  Top 0.406: U$1.21 75.95,61.98 71.31,61.98 70.29,60.96 68.58,60.96 66.04,58.42 v66.04,57.15 | v49.53,55.34 49.53,52.07 v48.26,50.8
  Bottom 0.406: v66.04,57.15 49.53,57.15 v49.53,55.34 | v48.26,50.8 44.45,50.8 U$9.12
V+
  Top 0.406: U$3.3 BAT.2
VIN  (7 unrouted)
  Top 0.406: J29.8 88.9,6.35 85.09,2.54 16.51,2.54 16.51,64.77 U$3.2 21.59,68.58 24.13,71.12 U$4.3 27.94,77.47 29.21,77.47 29.21,99.06 36.83,106.68 U$12.P$2
VSY
  Top 0.406: U$9.3 64.77,12.7 69.85,17.78 69.85,45.72 71.12,46.99 74.93,46.99 74.93,58.42 U$1.11
WR
  Bottom 0.406: U$9.10 72.39,30.48 U$1.14
WRST  (via drill 0.35)
  Top 0.406: U$1.22 78.74,67.31 68.58,67.31 67.31,66.04 67.31,63.5 63.5,59.69 v63.5,58.42 | v46.99,55.88 U$9.11
  Bottom 0.406: v63.5,58.42 46.99,58.42 v46.99,55.88

### Text on the board
tPlace: Cassius Clay | Motor A | Motor B